# EAGLE design Shield Input (EAGLE 7.2.0)
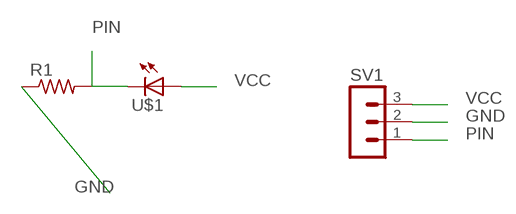
[diagram p0: schematic, sheet 1]

## Parts
R1  RESISTOR1206  [1206]
SV1  MA03-1  [MA03-1]
U$1  LED5MM  [5MM]

## Nets
GND: R1.1 SV1.2
PIN: R1.2 SV1.1 U$1.OUT(C)
VCC: SV1.3 U$1.IN(A)

## Library data of the parts
R1 = 01_FAB_Hello:RESISTOR
SV1 = con-lstb:MA03-1: PIN HEADER; OC_FARNELL: unknown; OC_NEWARK: unknown
U$1 = 01_FAB_Hello:LED

## Board
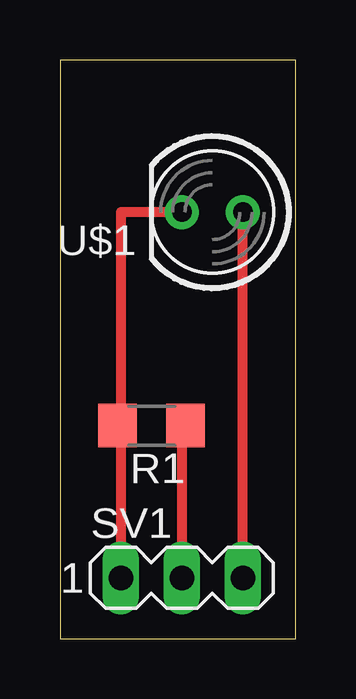
[diagram p1: board, top side]

Size 9.83 x 24.12 mm. Coordinates in mm from the lower left corner, seen from the top.
Outline: 0,0 9.83,0 9.83,24.12 0,24.12 0,0
Copper layers (1*16): Top 0.035mm / dielectric 1.5mm / Bottom 0.035mm
Design rules "default": minimum track width 10mil, minimum drill 24mil, track to track 8mil, track to pad 8mil, pad to pad 8mil, via to via 8mil, smd to smd 8mil, copper to edge 40mil, drill to drill 8mil, minimum pad ring 10mil, minimum via ring 8mil, stop-mask expansion 4mil, vias tented up to drill 0mil, thermal gap 10mil

### Footprints (pad centres in the part's own frame; a part is rotated, then mirrored left to right if it is on the bottom)
1206 = smd 1.6 x 1.803: 1 -1.422,0; 2 1.422,0
MA03-1 = drill 1.016 long: 1 -2.54,0; 2 0,0; 3 2.54,0
5MM = drill 0.813 pad 1.422: IN -1.27,0; OUT 1.27,0

### Placement (x,y rotation side)
R1  3.81,8.89 180 top
SV1  5.08,2.54 0 top
U$1  6.35,17.78 180 top

### Tracks (layer width: path | path; a pad name or v marks a point on that pad's centre or on a via)
GND
  Top 0.406: R1.1 5.08,8.89 SV1.2
PIN
  Top 0.406: U$1.OUT 2.54,17.78 2.54,8.89 | R1.2 2.54,8.89 | 2.54,8.89 SV1.1
VCC
  Top 0.406: SV1.3 U$1.IN